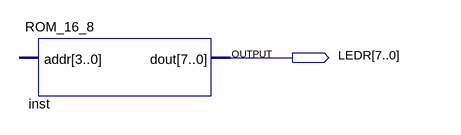
[diagram p0: schematic sheet]
// Quartus schematic ROM_Demo2.bdf as structural Verilog: 1 symbols, 1 pins
module ROM_Demo2 (
  output [7:0] LEDR
);

  ROM_16_8 inst (.dout(LEDR));  // open: addr
endmodule
